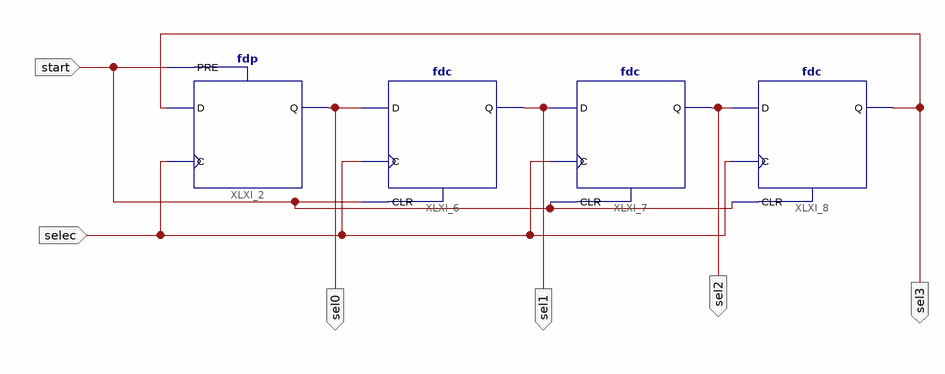
[diagram p0: schematic sheet 1]
// Xilinx ISE schematic selector.sch (spartan6) as structural Verilog: 4 symbols, 6 ports
module selector (
  input  selec,
  input  start,
  output sel3,
  output sel0,
  output sel1,
  output sel2
);

  fdp XLXI_2 (.C(selec), .D(sel3), .PRE(start), .Q(sel0));
  fdc XLXI_6 (.C(selec), .CLR(start), .D(sel0), .Q(sel1));
  fdc XLXI_7 (.C(selec), .CLR(start), .D(sel1), .Q(sel2));
  fdc XLXI_8 (.C(selec), .CLR(start), .D(sel2), .Q(sel3));
endmodule
